# Altium project Proyecto.PrjPCB
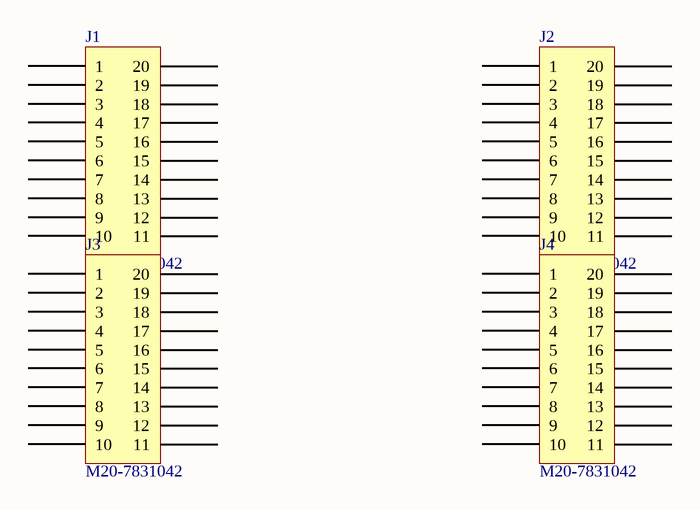
[diagram p0: esquematico.SchDoc]
1 sheet, 4 parts. Net scope: global (net labels, ports and power ports of the same name join across sheets).
Board file: PCB.PcbDoc

## Sheet esquematico.SchDoc
size A4

### Parts
J1  M20-7831042  [HARWIN M20-7831045]
J2  M20-7831042  [HARWIN M20-7831045]
J3  M20-7831042  [HARWIN M20-7831045]
J4  M20-7831042  [HARWIN M20-7831045]

### Nets

Not connected (* = marked no-connect by the designer): J1 1 2 3 4 5 6 7 8 9 10 11 12 13 14 15 16 17 18 19 20; J2 1 2 3 4 5 6 7 8 9 10 11 12 13 14 15 16 17 18 19 20; J3 1 2 3 4 5 6 7 8 9 10 11 12 13 14 15 16 17 18 19 20; J4 1 2 3 4 5 6 7 8 9 10 11 12 13 14 15 16 17 18 19 20

### Library data of the parts
J1-J4 = M20-7831042: CONN RCPT 20POS 0.1 GOLD PCB; Manufacturer: Harwin Inc.; Connector Type: Receptacle; Contact Length - Post: 0.118" (3.00mm); Current Rating (Amps): 3A; Mated Stacking Heights: 11.04mm, 12.63mm; Material Flammability Rating: UL94 V-0; Number of Positions: 20; Number of Positions Loaded: All; Pitch - Mating: 0.100" (2.54mm); Style: Board to Board or Cable; Part Number: M20-7831042; ComponentLink1Description: Datasheet; ComponentLink1URL: https://cdn.harwin.com/pdfs/C001XX_M20_Series_Connectors.pdf; ComponentLink2Description: DigiKey Link; ComponentLink2URL: https://www.digikey.com/en/products/detail/harwin-inc/M20-7831042/3727803; Contact Finish - Mating: Gold; Contact Finish - Post: Tin; Contact Finish Thickness - Mating: Flash; Contact Type: Female Socket; Fastening Type: Push-Pull; Insulation Color: Black; Insulation Height: 0.335" (8.51mm); LastUpdated: 21/9/2022 19:11:50; Lifecycle Status: Active; Minimum Order: 1; Mounting Type: Through Hole; Number of Rows: 2; Operating Temperature: -40°C ~ 105°C; Packaging: Tube; Part Status: Active; Price: 1.47; Row Spacing - Mating: 0.100" (2.54mm); Series: M20; Supplier 1: DigiKey; Supplier Part Number 1: 952-1836-ND; Termination: Solder